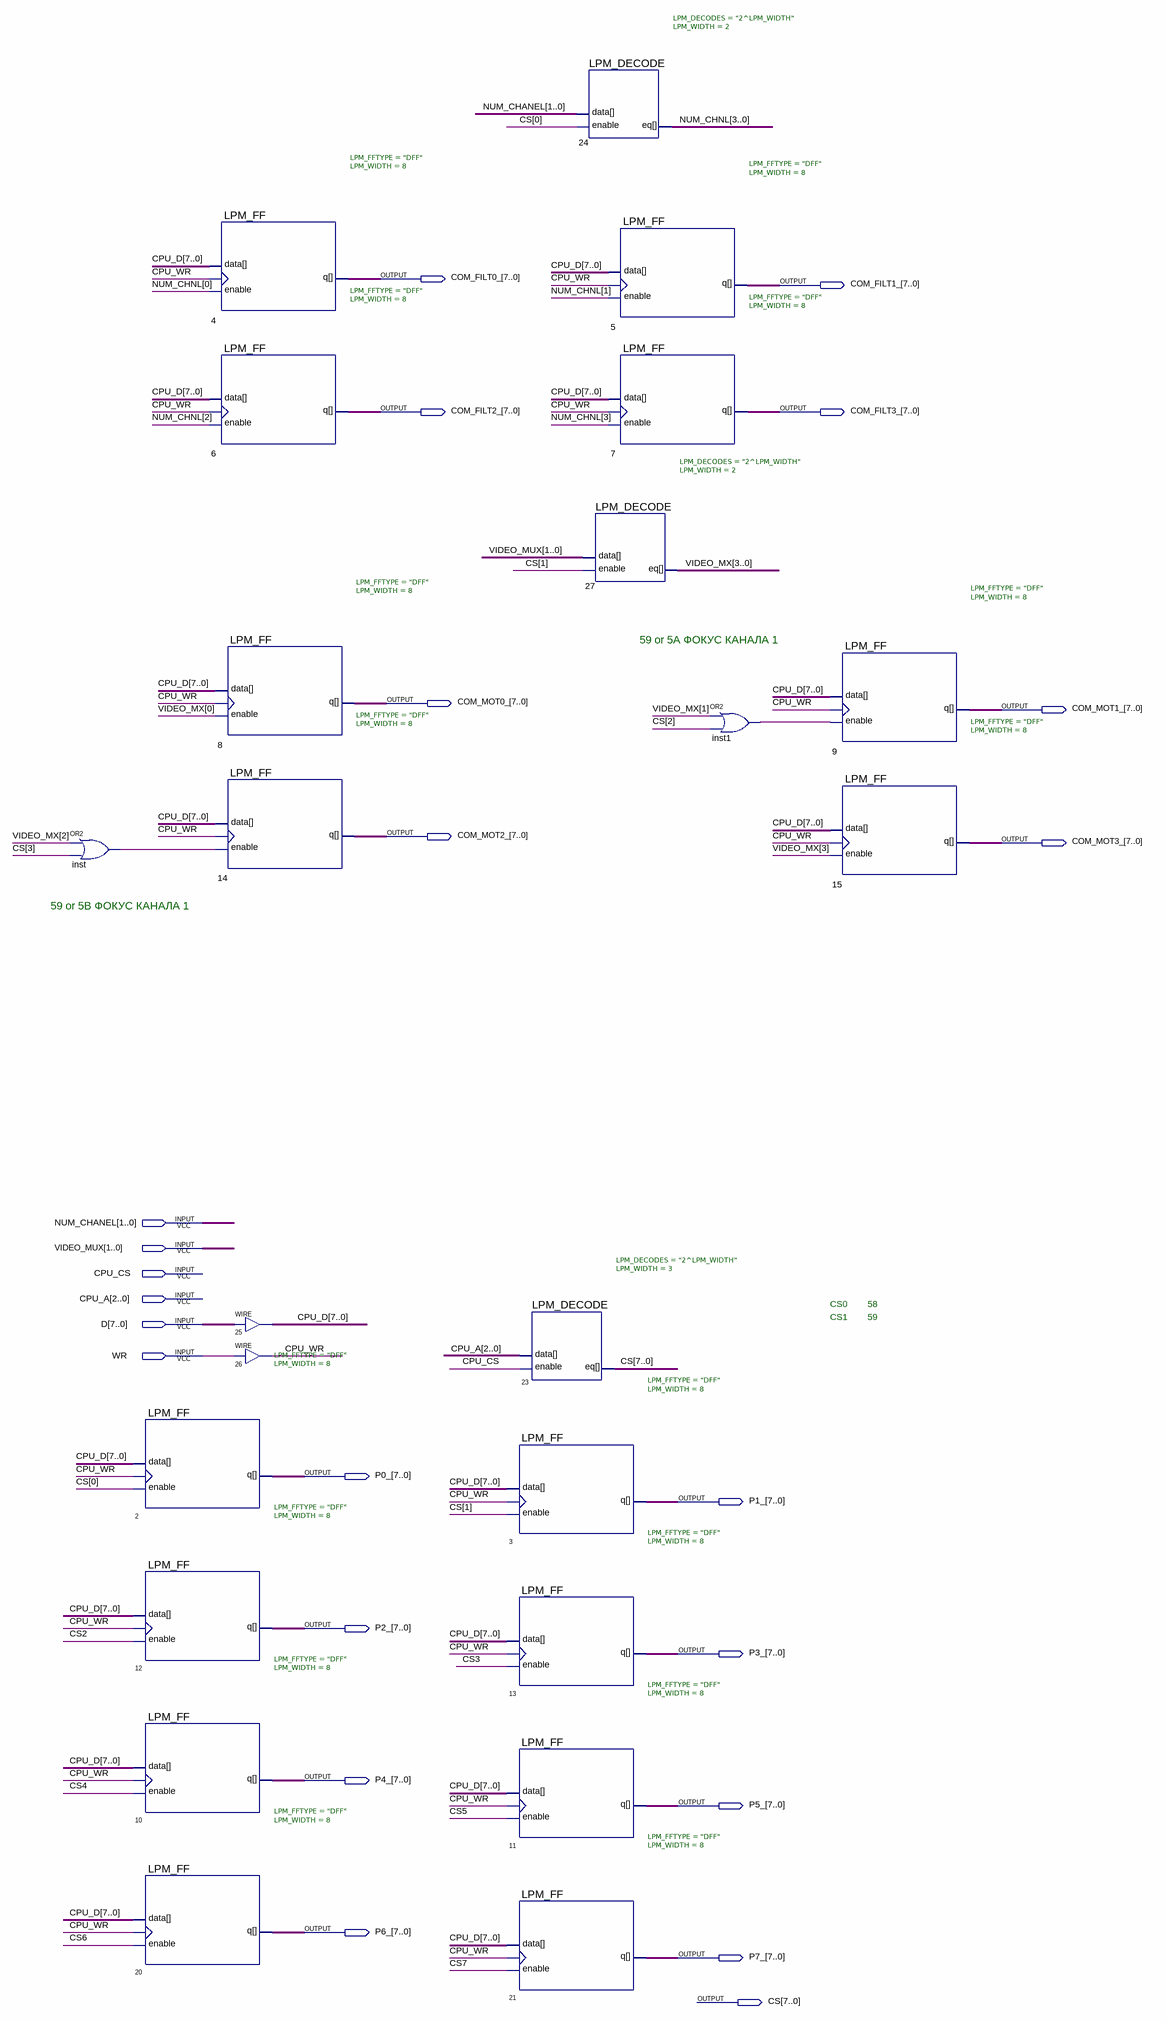
[diagram p0: schematic sheet]
// Quartus schematic rs_ports_me_108.bdf as structural Verilog: 23 symbols, 23 pins
module rs_ports_me_108 (
  input  [1:0] NUM_CHANEL,
  input  [1:0] VIDEO_MUX,
  input  CPU_CS,
  input  [2:0] CPU_A,
  input  [7:0] D,
  input  WR,
  output [7:0] COM_FILT0_,
  output [7:0] COM_FILT1_,
  output [7:0] COM_FILT2_,
  output [7:0] COM_FILT3_,
  output [7:0] COM_MOT0_,
  output [7:0] COM_MOT1_,
  output [7:0] COM_MOT2_,
  output [7:0] COM_MOT3_,
  output [7:0] P0_,
  output [7:0] P1_,
  output [7:0] P2_,
  output [7:0] P3_,
  output [7:0] P4_,
  output [7:0] P5_,
  output [7:0] P6_,
  output [7:0] P7_,
  output [7:0] CS
);

  wire CPU_WR, inst1_out, inst_out;
  wire [3:0] NUM_CHNL, VIDEO_MX;
  wire [7:0] CPU_D;

  or inst (inst_out, VIDEO_MX[2], CS[3]);
  LPM_FF #(.LPM_FFTYPE("DFF"), .LPM_WIDTH(8)) u_2 (.enable(CS[0]), .clock(CPU_WR), .data(CPU_D), .q(P0_));
  LPM_FF #(.LPM_FFTYPE("DFF"), .LPM_WIDTH(8)) u_12 (.enable(CS[2]), .clock(CPU_WR), .data(CPU_D), .q(P2_));
  LPM_FF #(.LPM_FFTYPE("DFF"), .LPM_WIDTH(8)) u_10 (.enable(CS[4]), .clock(CPU_WR), .data(CPU_D), .q(P4_));
  LPM_FF #(.LPM_FFTYPE("DFF"), .LPM_WIDTH(8)) u_20 (.enable(CS[6]), .clock(CPU_WR), .data(CPU_D), .q(P6_));
  LPM_FF #(.LPM_FFTYPE("DFF"), .LPM_WIDTH(8)) u_4 (.enable(NUM_CHNL[0]), .clock(CPU_WR), .data(CPU_D), .q(COM_FILT0_));
  LPM_FF #(.LPM_FFTYPE("DFF"), .LPM_WIDTH(8)) u_6 (.enable(NUM_CHNL[2]), .clock(CPU_WR), .data(CPU_D), .q(COM_FILT2_));
  LPM_FF #(.LPM_FFTYPE("DFF"), .LPM_WIDTH(8)) u_8 (.enable(VIDEO_MX[0]), .clock(CPU_WR), .data(CPU_D), .q(COM_MOT0_));
  LPM_FF #(.LPM_FFTYPE("DFF"), .LPM_WIDTH(8)) u_14 (.enable(inst_out), .clock(CPU_WR), .data(CPU_D), .q(COM_MOT2_));
  assign CPU_D = D;  // WIRE 25
  assign CPU_WR = WR;  // WIRE 26
  LPM_DECODE #(.LPM_DECODES("2^LPM_WIDTH"), .LPM_WIDTH(3)) u_23 (.enable(CPU_CS), .data(CPU_A), .eq(CS));
  LPM_FF #(.LPM_FFTYPE("DFF"), .LPM_WIDTH(8)) u_3 (.enable(CS[1]), .clock(CPU_WR), .data(CPU_D), .q(P1_));
  LPM_FF #(.LPM_FFTYPE("DFF"), .LPM_WIDTH(8)) u_13 (.enable(CS[3]), .clock(CPU_WR), .data(CPU_D), .q(P3_));
  LPM_FF #(.LPM_FFTYPE("DFF"), .LPM_WIDTH(8)) u_11 (.enable(CS[5]), .clock(CPU_WR), .data(CPU_D), .q(P5_));
  LPM_FF #(.LPM_FFTYPE("DFF"), .LPM_WIDTH(8)) u_21 (.enable(CS[7]), .clock(CPU_WR), .data(CPU_D), .q(P7_));
  LPM_DECODE #(.LPM_DECODES("2^LPM_WIDTH"), .LPM_WIDTH(2)) u_24 (.enable(CS[0]), .data(NUM_CHANEL), .eq(NUM_CHNL));
  LPM_DECODE #(.LPM_DECODES("2^LPM_WIDTH"), .LPM_WIDTH(2)) u_27 (.enable(CS[1]), .data(VIDEO_MUX), .eq(VIDEO_MX));
  LPM_FF #(.LPM_FFTYPE("DFF"), .LPM_WIDTH(8)) u_5 (.enable(NUM_CHNL[1]), .clock(CPU_WR), .data(CPU_D), .q(COM_FILT1_));
  LPM_FF #(.LPM_FFTYPE("DFF"), .LPM_WIDTH(8)) u_7 (.enable(NUM_CHNL[3]), .clock(CPU_WR), .data(CPU_D), .q(COM_FILT3_));
  or inst1 (inst1_out, VIDEO_MX[1], CS[2]);
  LPM_FF #(.LPM_FFTYPE("DFF"), .LPM_WIDTH(8)) u_9 (.enable(inst1_out), .clock(CPU_WR), .data(CPU_D), .q(COM_MOT1_));
  LPM_FF #(.LPM_FFTYPE("DFF"), .LPM_WIDTH(8)) u_15 (.enable(VIDEO_MX[3]), .clock(CPU_WR), .data(CPU_D), .q(COM_MOT3_));

  // Notes on the sheet:
  //   59 or 5А ФОКУС КАНАЛА 1
  //   59 or 5В ФОКУС КАНАЛА 1
  //   CS0        58
  //   CS1        59
endmodule
